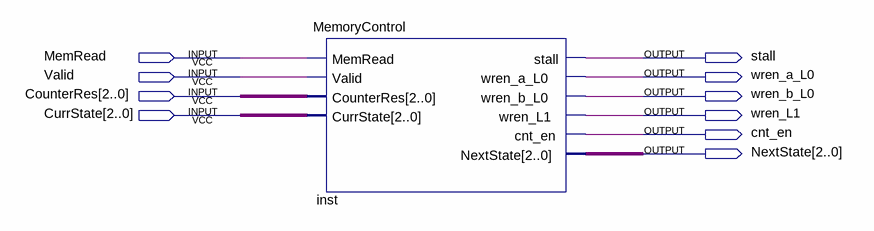
[diagram p0: schematic sheet]
// Quartus schematic TesteMemoryControl.bdf as structural Verilog: 1 symbols, 10 pins
module TesteMemoryControl (
  input  MemRead,
  input  Valid,
  input  [2:0] CounterRes,
  input  [2:0] CurrState,
  output stall,
  output wren_a_L0,
  output wren_b_L0,
  output wren_L1,
  output cnt_en,
  output [2:0] NextState
);

  MemoryControl inst (
    .MemRead(MemRead), .Valid(Valid), .CounterRes(CounterRes), .CurrState(CurrState), .stall(stall),
    .wren_a_L0(wren_a_L0), .wren_b_L0(wren_b_L0), .wren_L1(wren_L1), .cnt_en(cnt_en), .NextState(NextState));
endmodule
